# Altium schematic sheet Buzzer.SchDoc
size A4
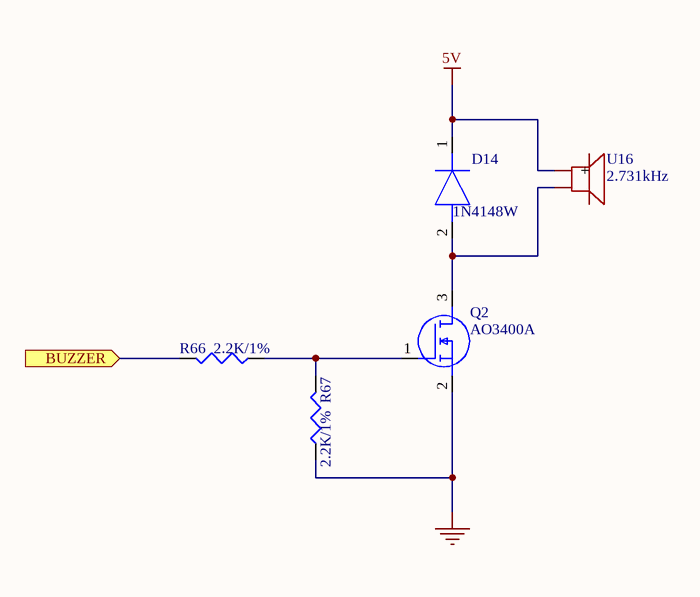
[diagram p0: Buzzer.SchDoc]

## Parts
D14  1N4148W  [1N4148WVGS08]
Q2  AO3400A  [SOT95P280X125-3N]
R66  2.2K/1%  [R0402]
R67  2.2K/1%  [R0402]
U16  2.731kHz  [BUZ-SMD_4P-L7.5-W7.5-BR]

## Ports
BUZZER (in, see VESC_75100[3C])

## Nets
5V: D14.1(K) U16.1(+)
GND: Q2.2(S) R67.1
BUZZER: R66.2 ; port BUZZER
NetD14_2: D14.2(A) Q2.3(D) U16.2
NetQ2_1: Q2.1(G) R66.1 R67.2

Not connected (* = marked no-connect by the designer): U16 3 4

## Library data of the parts
D14 = 1N4148W-V-GS08: Diode; Manufacturer_Name: Vishay; Datasheet Link: https://us.rs-online.com/m/d/a2789c8794cb0c42ced29f2dd8571f3c.pdf; Height: 1.35mm; Manufacturer_Part_Number: 1N4148W-V-GS08; Mouser Part Number: 625-1N4148W-V; Mouser Price/Stock: https://www.mouser.co.uk/ProductDetail/Vishay-Semiconductors/1N4148W-V-GS08?qs=TNTIDjy6APrS%2Fdgq1RSs3A%3D%3D; Arrow Part Number: 1N4148W-V-GS08; Arrow Price/Stock: https://www.arrow.com/en/products/1n4148w-v-gs08/vishay
Q2 = AO3400A: MOSFET (N-Channel); Manufacturer_Name: Alpha & Omega Semiconductors; Datasheet Link: http://aosmd.com/res/data_sheets/AO3400A.pdf; Height: 1.25mm; Manufacturer_Part_Number: AO3400A; Arrow Part Number: AO3400A; Arrow Price/Stock: https://www.arrow.com/en/products/ao3400a/alpha-and-omega-semiconductor?utm_currency=USD&region=nac
R66 R67 = RESISTOR: PCB Footprint: R0402
U16 = HYG-7525A: Manufacturer: HYDZ(华宇); Add into BOM: yes; Current Consumption: 90mA; Sound Pressure Level(SPL): 85dB; Symbol: HYG-7525A; Device: HYG-7525A; LCSC Part Name: 贴片无源蜂鸣器; Supplier Part: C7544812; Manufacturer Part: HYG-7525A; Supplier Footprint: SMD,7.5x7.5mm; JLCPCB Part Class: 扩展库; Datasheet: https://atta.szlcsc.com/upload/public/pdf/source/20230825/78098EC44B170663F3151CF5366FAD5D.pdf; Supplier: LCSC; Convert to PCB: yes; Value: 2.731kHz